# Altium schematic sheet High_Power.SchDoc
size A4
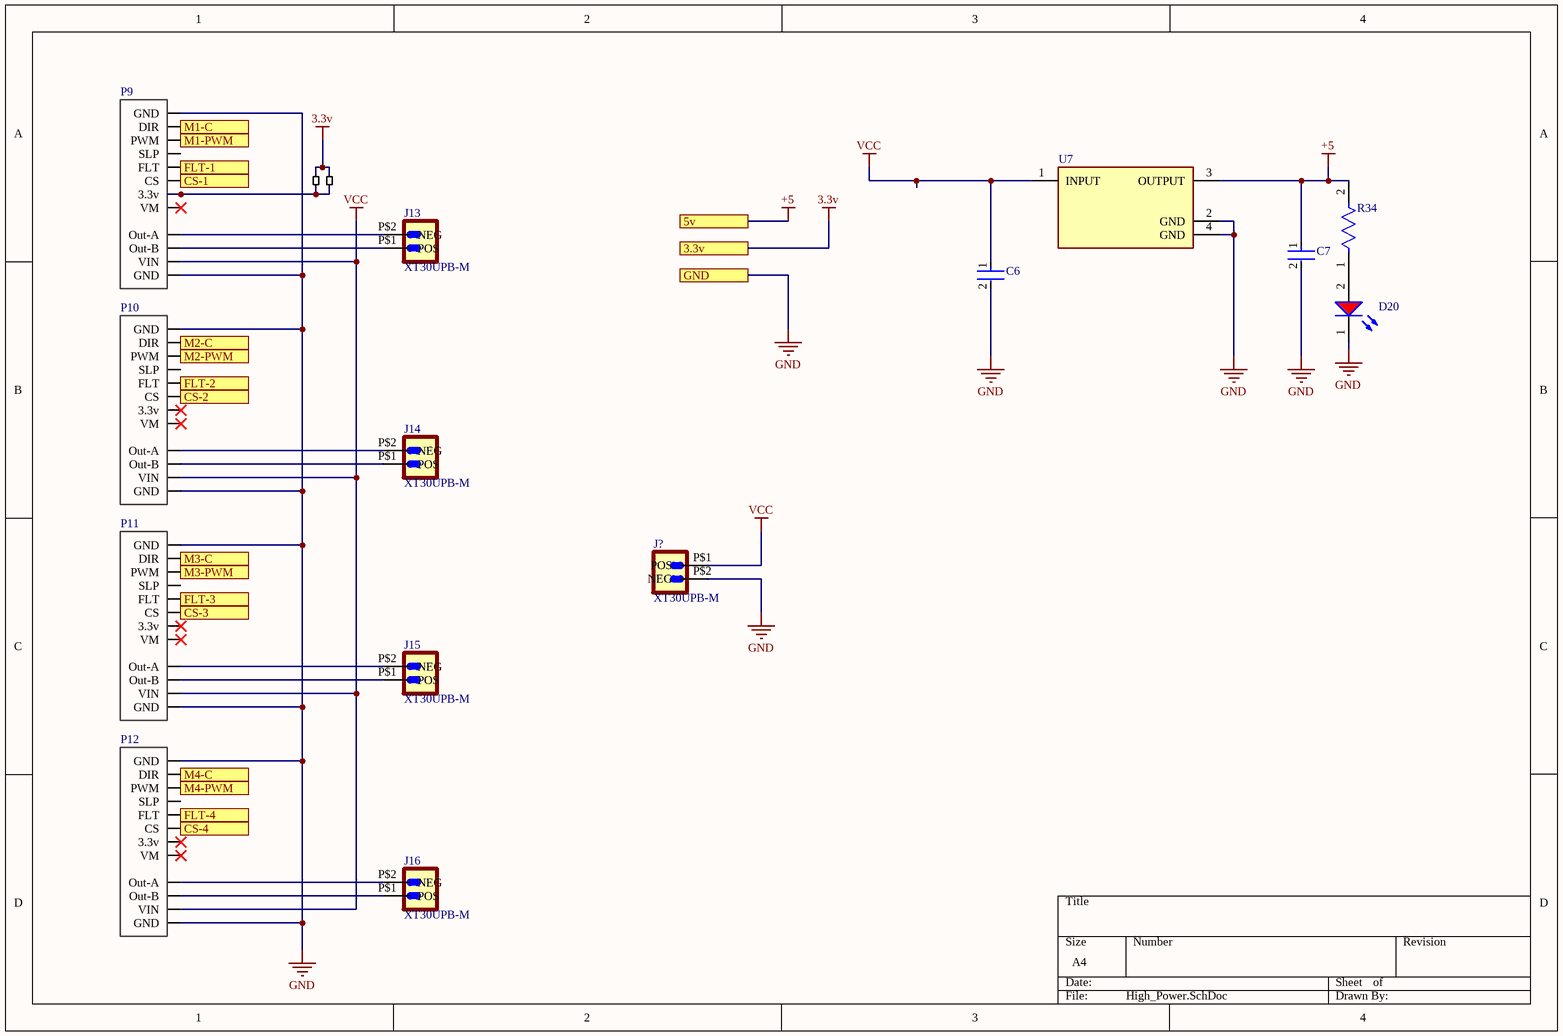
[diagram p0: High_Power.SchDoc]

## Parts
C6  GRM31CR71A226KE15L  [FP-GRM31C-0_2-e0_3_0_8-MFG]  (value not drawn)
C7  GRM31CR71A226KE15L  [FP-GRM31C-0_2-e0_3_0_8-MFG]  (value not drawn)
D20  150080SS75000  [WL-SMCW_0805_150080xx75000]  (value not drawn)
J13  XT30UPB-M  [XT30UPB-M]
J14  XT30UPB-M  [XT30UPB-M]
J15  XT30UPB-M  [XT30UPB-M]
J16  XT30UPB-M  [XT30UPB-M]
J?  XT30UPB-M  [XT30UPB-M]
P9  Pololu G2 High-Power Motor Driver 18v25  [Pololu G2 High-Power Motor Driver 18v25]  (value not drawn)
P10  Pololu G2 High-Power Motor Driver 18v25  [Pololu G2 High-Power Motor Driver 18v25]  (value not drawn)
P11  Pololu G2 High-Power Motor Driver 18v25  [Pololu G2 High-Power Motor Driver 18v25]  (value not drawn)
P12  Pololu G2 High-Power Motor Driver 18v25  [Pololu G2 High-Power Motor Driver 18v25]  (value not drawn)
R34  CRCW080510K0FKEA  [FP-CRCW0805-e3-IPC_A]  (value not drawn)
U7  LM7805MP/NOPB  [FP-DCY0004A-MFG]  (value not drawn)
W25  Jumper  [Jumper Mid]  (value not drawn)
W26  Jumper  [Jumper Mid]  (value not drawn)

## Ports
3.3v, 5v, CS-1, CS-2, CS-3, CS-4, FLT-1, FLT-2, FLT-3, FLT-4, GND, M1-C, M1-PWM, M2-C, M2-PWM, M3-C, M3-PWM, M4-C, M4-PWM

## Nets
3.3v: W25.2 W26.2 ; port 3.3v
+5: C7.1 R34.2 U7.3(OUTPUT) ; port 5v
GND: C6.2 C7.2 D20.1(K) J?.P$2(NEG) P9.1(GND) P9.12(GND) P10.1(GND) P10.12(GND) P11.1(GND) P11.12(GND) P12.1(GND) P12.12(GND) U7.2(GND) U7.4(GND) ; port GND
VCC: C6.1 J?.P$1(POS) P9.11(VIN) P10.11(VIN) P11.11(VIN) P12.11(VIN) U7.1(INPUT)
CS-1: P9.6(CS) ; port CS-1
CS-2: P10.6(CS) ; port CS-2
CS-3: P11.6(CS) ; port CS-3
CS-4: P12.6(CS) ; port CS-4
FLT-1: P9.5(FLT) ; port FLT-1
FLT-2: P10.5(FLT) ; port FLT-2
FLT-3: P11.5(FLT) ; port FLT-3
FLT-4: P12.5(FLT) ; port FLT-4
M1-C: P9.2(DIR) ; port M1-C
M1-PWM: P9.3(PWM) ; port M1-PWM
M2-C: P10.2(DIR) ; port M2-C
M2-PWM: P10.3(PWM) ; port M2-PWM
M3-C: P11.2(DIR) ; port M3-C
M3-PWM: P11.3(PWM) ; port M3-PWM
M4-C: P12.2(DIR) ; port M4-C
M4-PWM: P12.3(PWM) ; port M4-PWM
NetD20_2: D20.2(A) R34.1
NetJ13_P$1: J13.P$1(POS) P9.10(Out-B)
NetJ13_P$2: J13.P$2(NEG) P9.9(Out-A)
NetJ14_P$1: J14.P$1(POS) P10.10(Out-B)
NetJ14_P$2: J14.P$2(NEG) P10.9(Out-A)
NetJ15_P$1: J15.P$1(POS) P11.10(Out-B)
NetJ15_P$2: J15.P$2(NEG) P11.9(Out-A)
NetJ16_P$1: J16.P$1(POS) P12.10(Out-B)
NetJ16_P$2: J16.P$2(NEG) P12.9(Out-A)
NetP9_7: P9.7(3.3v) W25.1 W26.1

Not connected (* = marked no-connect by the designer): P9 4(SLP) 8(VM)*; P10 4(SLP) 7(3.3v)* 8(VM)*; P11 4(SLP) 7(3.3v)* 8(VM)*; P12 4(SLP) 7(3.3v)* 8(VM)*

## Library data of the parts
C6 C7 = CMP-06035-003841-1: Chip Multilayer Ceramic Capacitors for General Purpose, 1206, 22uF, X7R, 15%, 10%, 10V; Height: 1.6mm; Width: 0.063inch; Min Operating Temperature: -55°C; Package Quantity: 1; Termination: SMD/SMT; Length: 3.2mm; Voltage Rating: 10V; Case/Package: 1206; Capacitance: 22uF; Case Code (Imperial): 1206; Depth: 1.6mm; Dielectric: X7R; Voltage: 10V; Material: Ceramic; Tolerance: 10%; Voltage Rating (DC): 10V; Lead Free: Lead Free; Max Operating Temperature: 125°C; Case Code (Metric): 3216; Packaging: Tape and Reel; Thickness: 0.071inch; Radiation Hardening: No; REACH SVHC: No SVHC; Mount: Surface Mount
D20 = CMP-1426-00010-3: NexarPartId: 29717782; Peak Wavelength: 645nm; Luminous Intensity: 60mcd; Max Junction Temperature (Tj): 95°C; Wavelength: 630nm; Forward Current: 100mA; Max Reverse Voltage (DC): 5V; Color: Red; Lens Style: Clear, Rectangular; Test Current: 20mA; Power Dissipation: 72mW; Viewing Angle: 140°; Forward Voltage: 1.9V; Case Code (Metric): 2012; Max Operating Temperature: 85°C; Mount: Surface Mount; Height: 700µm; Case/Package: 0805; Min Operating Temperature: -40°C; Reverse Voltage: 5V; RoHS: Compliant; Packaging: Tape and Reel; REACH SVHC: Unknown; Case Code (Imperial): 0805; Length: 2mm; Width: 1.25mm; Dominant Wavelength: 630nm
J13-J16 J? = XT30UPB-M: Socket; DC supply; XT30; male; PIN: 2; on PCBs; THT; yellow; 15A; 500V; MF: amass; MP: XT30UPB-M; Value: *; SnapEDA_Link: https://www.snapeda.com/parts/XT30UPB-M/AMASS/view-part/?ref=snap; Price: None; Package: None; Check_prices: https://www.snapeda.com/parts/XT30UPB-M/AMASS/view-part/?ref=eda; Availability: Not in stock
R34 = CMP-2001-04908-2: RES Thick Film, 10kΩ, 1%, 0.125W, 100ppm/°C, 0805; Resistance: 10kR; Voltage Rating (DC): 150V; Power Rating: 125mW; Weight: 0.000194oz; Package Quantity: 5000; Military Standard: Not; Max Operating Temperature: 155°C; Temperature Coefficient: 100ppm/°C; Contact Plating: Tin; Width: 1.25mm; Height: 0.45mm; Radiation Hardening: No; Tolerance: 1%; Min Operating Temperature: -55°C; Voltage Rating: 150V; Length: 2mm; Depth: 1.25mm; Termination: SMD/SMT; Packaging: Tape and Reel; Case/Package: 0805; Case Code (Metric): 2012; Lead Free: Lead Free; Case Code (Imperial): 0805; Composition: Thick Film
U7 = CMP-04917-000007-1: IC REG LINEAR 5V 1.5A SOT223-4; Manufacturer: Texas Instruments; Max Supply Voltage: 30V; Max Junction Temp: +150°C; Number Of Outputs: 1; Standoff Height: 0.02mm; Dropout Voltage: 2V; Accuracy Percentage: 3%; Nominal Supply Current: 8mA; Output Type: Fixed; Min Supply Voltage: 7.5V; Lead Free: Yes; Device Class L1: Integrated Circuits (ICs); Manufacturer Part Number: LM7805MP/NOPB; Package: DCY0004A; ComponentLink2Description: Datasheet; Temperature Range Low: 0°C; ComponentLink2URL: http://www.ti.com/lit/ds/symlink/lm7800.pdf; Height: 1.8mm; Temperature: 0°C to +125°C; Category: IC; Device Class L3: Voltage Regulators - Linear; Octopart: https://octopart.com/lm7805mp%2Fnopb-texas+instruments-74629991; Device Class L2: Power Management ICs; Output Voltage: 5V; RoHS: TRUE; Temperature Range High: +125°C; Automotive: No; Digikey Description: IC REG LINEAR 5V 1.5A SOT223-4; Output Current: 1.5A